# EAGLE design espiotv2 (EAGLE 7.6.0)
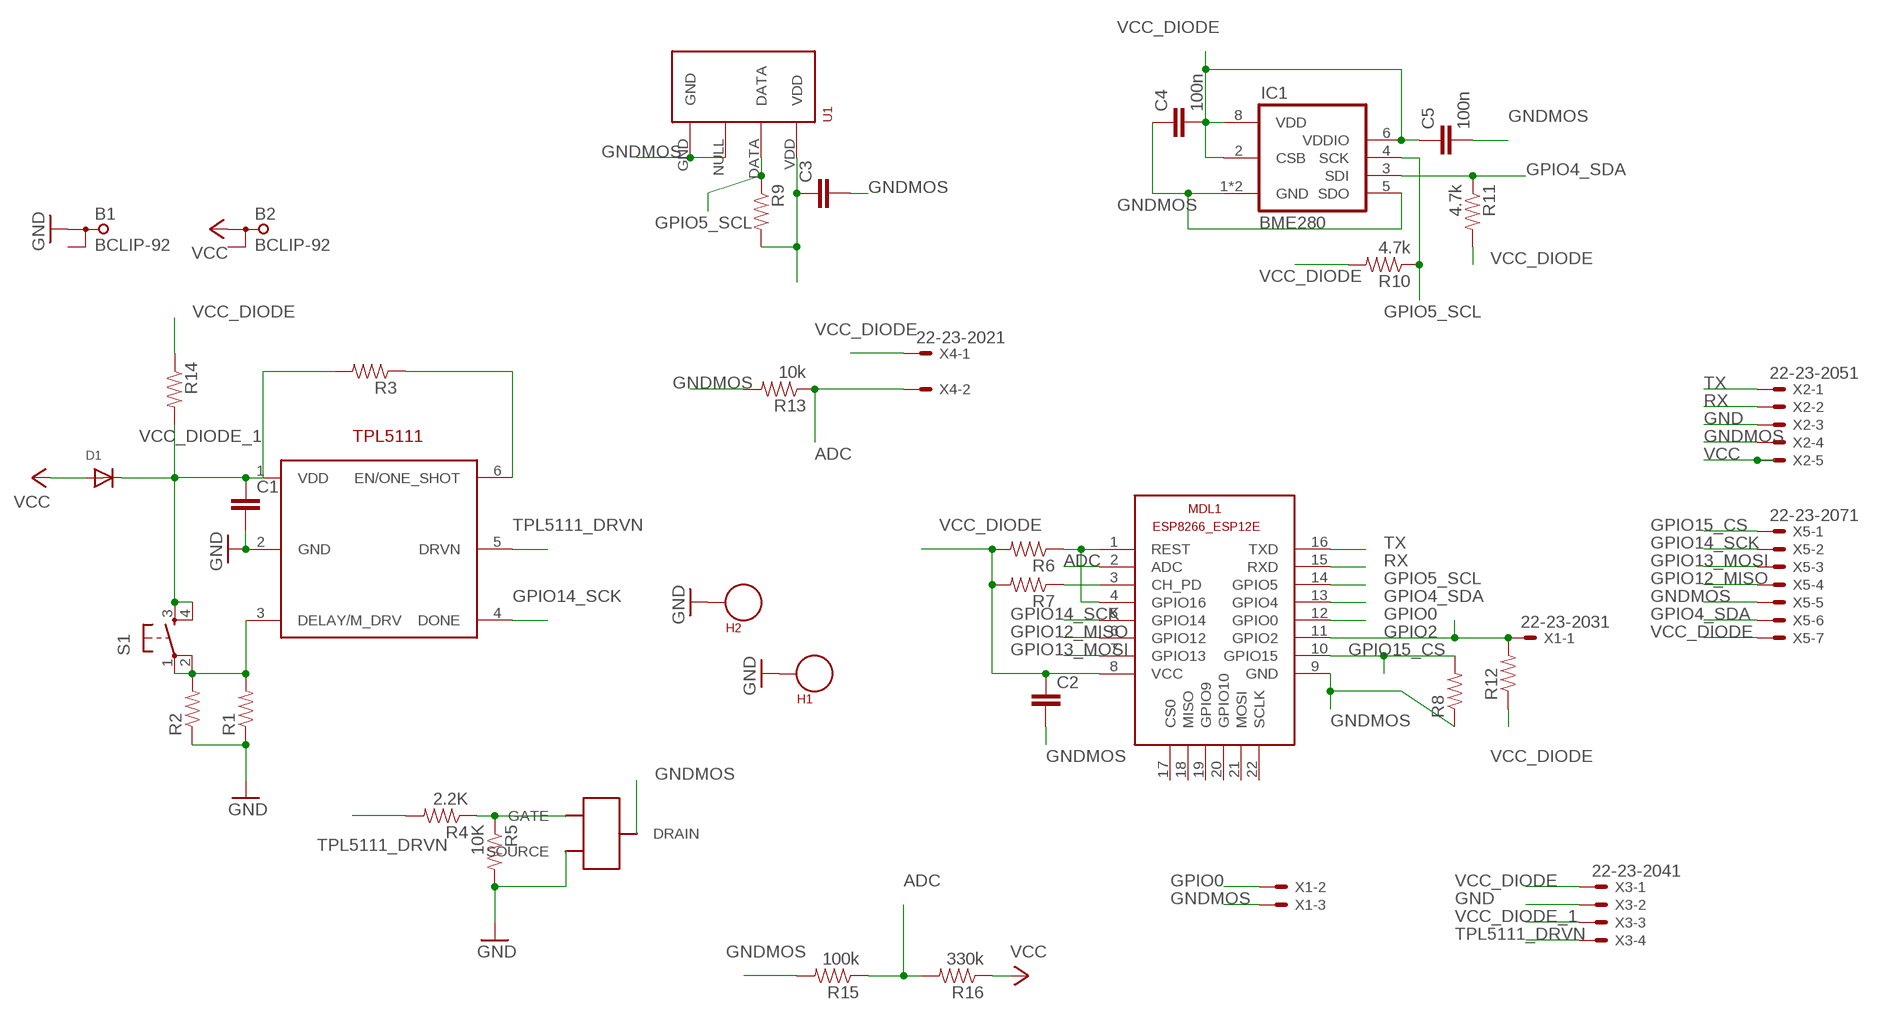
[diagram p0: schematic, sheet 1]

## Parts
B1  BCLIP-92  [BCLIP-92]
B2  BCLIP-92  [BCLIP-92]
C1  CAP0603-CAP  [0603-CAP]
C2  CAP0603-CAP  [0603-CAP]
C3  CAP0603-CAP  [0603-CAP]
C4  100n  CAP0603-CAP  [0603-CAP]
C5  100n  CAP0603-CAP  [0603-CAP]
D1  DIODEDO-1N4148  [DO-1N4148]
H1  SEW_HOLE  [SIMPLE_HOLE]
H2  SEW_HOLE  [SIMPLE_HOLE]
IC1  BME280  [BME280]
MDL1  ESP8266-12EESP8266-ESP12E  [ESP8266-ESP12E]
R1  RESISTOR0603-RES  [0603-RES]
R2  RESISTOR0603-RES  [0603-RES]
R3  RESISTOR0603-RES  [0603-RES]
R4  2.2K  RESISTOR0603-RES  [0603-RES]
R5  10K  RESISTOR0603-RES  [0603-RES]
R6  RESISTOR0603-RES  [0603-RES]
R7  RESISTOR0603-RES  [0603-RES]
R8  RESISTOR0603-RES  [0603-RES]
R9  RESISTOR0603-RES  [0603-RES]
R10  4.7k  RESISTOR0603-RES  [0603-RES]
R11  4.7k  RESISTOR0603-RES  [0603-RES]
R12  RESISTOR0603-RES  [0603-RES]
R13  10k  RESISTOR0603-RES  [0603-RES]
R14  RESISTOR0603-RES  [0603-RES]
R15  100k  RESISTOR0603-RES  [0603-RES]
R16  330k  RESISTOR0603-RES  [0603-RES]
S1  TAC_SWITCHPTH  [TACTILE-PTH]
U1  RHT03_DHT-22_AM2302WIRED  [AM2302]
U$1  TPL5111  [TPL5111]
U$2  IRLML2502  [IRLML2502]
X1  22-23-2031  [22-23-2031]
X2  22-23-2051  [22-23-2051]
X3  22-23-2041  [22-23-2041]
X4  22-23-2021  [22-23-2021]
X5  22-23-2071  [22-23-2071]

## Nets
ADC: MDL1.2(ADC) R13.1 R15.1 R16.2 X4.2
GND: B1.P$1 C1.2 H1.P$1 H2.P$1 R1.1 R2.1 R5.2 U$1.2(GND) U$2.S(SOURCE) X2.3 X3.2
GNDMOS: C2.2 C3.2 C4.1 C5.2 IC1.1(GND) IC1.5(SDO) IC1.7(GND) MDL1.9(GND) R8.1 R13.2 R15.2 U1.GND U1.NULL U$2.D(DRAIN) X1.3 X2.4 X5.5
GPIO0: MDL1.12(GPIO0) X1.2
GPIO2: MDL1.11(GPIO2) R12.2 X1.1
GPIO4_SDA: IC1.3(SDI) MDL1.13(GPIO4) R11.1 X5.6
GPIO5_SCL: IC1.4(SCK) MDL1.14(GPIO5) R9.1 R10.1 U1.DATA
GPIO12_MISO: MDL1.6(GPIO12) X5.4
GPIO13_MOSI: MDL1.7(GPIO13) X5.3
GPIO14_SCK: MDL1.5(GPIO14) U$1.4(DONE) X5.2
GPIO15_CS: MDL1.10(GPIO15) R8.2 X5.1
N$2: R4.1 R5.1 U$2.G(GATE)
N$3: R1.2 R2.2 S1.1 S1.2 U$1.3(DELAY/M_DRV)
N$4: MDL1.1(REST) MDL1.4(GPIO16) R6.1
N$5: MDL1.3(CH_PD) R7.1
N$6: R3.1 U$1.6(EN/ONE_SHOT)
RX: MDL1.15(RXD) X2.2
TPL5111_DRVN: R4.2 U$1.5(DRVN) X3.4
TX: MDL1.16(TXD) X2.1
VCC: B2.P$1 D1.A R16.1 X2.5
VCC_DIODE: C2.1 C3.1 C4.2 C5.1 IC1.2(CSB) IC1.6(VDDIO) IC1.8(VDD) MDL1.8(VCC) R6.2 R7.2 R9.2 R10.2 R11.2 R12.1 R14.1 U1.VDD X3.1 X4.1 X5.7
VCC_DIODE_1: C1.1 D1.C R3.2 R14.2 S1.3 S1.4 U$1.1(VDD) X3.3
Unconnected: B1.P$2 B2.P$2 MDL1.17(CS0) MDL1.18(MISO) MDL1.19(GPIO9) MDL1.20(GPIO10) MDL1.21(MOSI) MDL1.22(SCLK)

## Library data of the parts
B1 B2 = keystone_clip:BCLIP-92: Battery Clip - #92
C1-C5 = SparkFun-Capacitors:CAP: Capacitor Standard 0603 ceramic capacitor, and 0.1" leaded capacitor.
D1 = adafruit:DIODE: Diode SMADIODE - SMA Surface Mount Package 20V 1A Schottky Diode Digikey: 641-1014-6-ND DO-1N4148 - Through Hole Small Current Diode SOD-123 20V 1 A (.5mV Vf) Schottky Diode - Digikey: MBRX120TPMSCT-ND SOD-323 10V 570mA (.38mV Vf, 3ns) Schottky Diode - Digikey: ZLLS410CT-ND SOD-523 30V 30mA Schottky Diode (RB751S-40TE61) - Digikey: RB751S-40TE61CT-ND SOT23-R/W - SOT23 Package (R = Solder Paste/Reflow Ovens, W = Hand-Soldering) BAT54Film 40V 300mA - Digikey: 497-7162-1-ND
H1 H2 = LilyPad-Wearables (2):SEW_HOLE: Simple sew-hole .1" diameter hole with 20mil annular ring
IC1 = bosch-bme280:BME280: DIGITAL HUMIDITY, PRESSURE AND TEMPERATURE SENSOR * Digital interface I²C (up to 3.4 MHz) and SPI (3 and 4 wire, up to 10 MHz)* Supply voltage VDD main supply voltage range: 1.71 V to 3.6 V*VDDIO interface voltage range: 1.2 V to 3.6 V Operating range -40…+85 °C, 0…100 % rel. humidity, 300…1100 hPa The library has been designed by Richard Magdycz <https://www.facebook.com/groups/eaglecadsoftUK>
MDL1 = esp-12E:ESP8266-12E: ESP8266-12E with additional I/O and GPIO04/05 corrected The author cannot warrant that this library is free from error or will meet your specific requirements. Created by PuceBaboon.com. Komagane, Nagano, JAPAN
R1-R16 = SparkFun:RESISTOR: Resistor Basic schematic elements and footprints for 0603, 1206, and PTH resistors.
S1 = SparkFun:TAC_SWITCH: Momentary Switch Button commonly used for reset or general input. Spark Fun Electronics SKU : COM-00097
U1 = dht-22:RHT03_DHT-22_AM2302: RHT03 / DHT-22 / AM2302 Packages and symbol for the RHT03 / DHT-22 relative humidity and temperature sensor. Note: The AM2302 is a wired version of the DHT-22 which typically requires less clearance and is thus provided as a separate package.; PROD_ID: SEN-10167
U$1 = TPL5111_2:TPL5111
U$2 = IRLML2502:IRLML2502
X1 = con-molex:22-23-2031: .100" (2.54mm) Center Header - 3 Pin; MF: MOLEX; MPN: 22-23-2031; OC_FARNELL: 1462950; OC_NEWARK: 30C0862
X2 = con-molex:22-23-2051: .100" (2.54mm) Center Header - 5 Pin; MF: MOLEX; MPN: 22-23-2051; OC_FARNELL: 1462952; OC_NEWARK: 38C9178
X3 = con-molex:22-23-2041: .100" (2.54mm) Center Header - 4 Pin; MF: MOLEX; MPN: 22-23-2041; OC_FARNELL: 1462920; OC_NEWARK: 38C0355
X4 = con-molex:22-23-2021: .100" (2.54mm) Center Header - 2 Pin; MF: MOLEX; MPN: 22-23-2021; OC_FARNELL: 1462926; OC_NEWARK: 25C3832
X5 = con-molex:22-23-2071: .100" (2.54mm) Center Header - 7 Pin; MF: MOLEX; MPN: 22-23-2071; OC_FARNELL: 1654534; OC_NEWARK: 56H0445

## Board
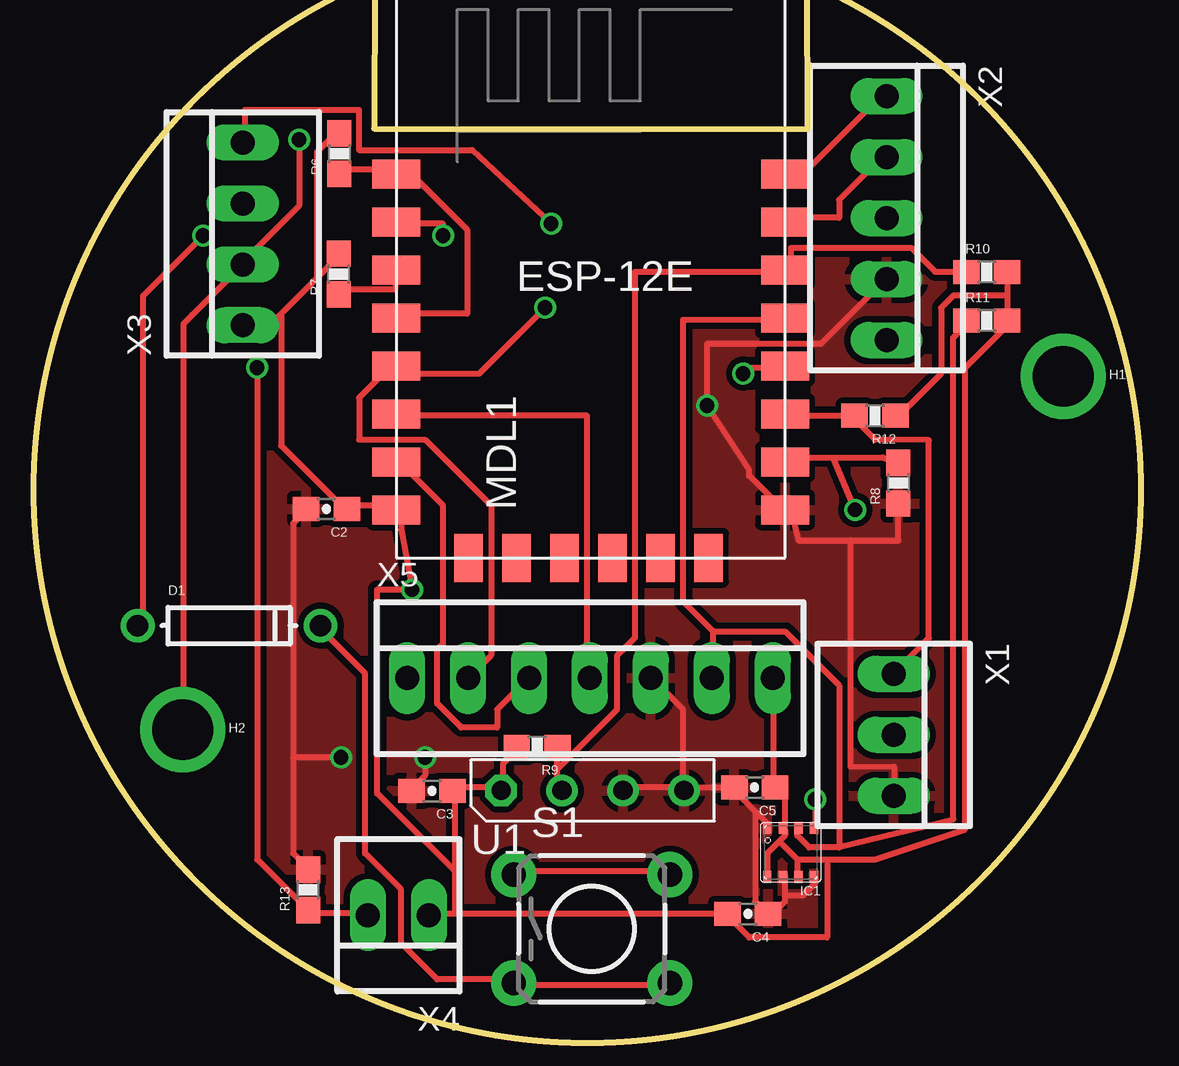
[diagram p1: board, top side]
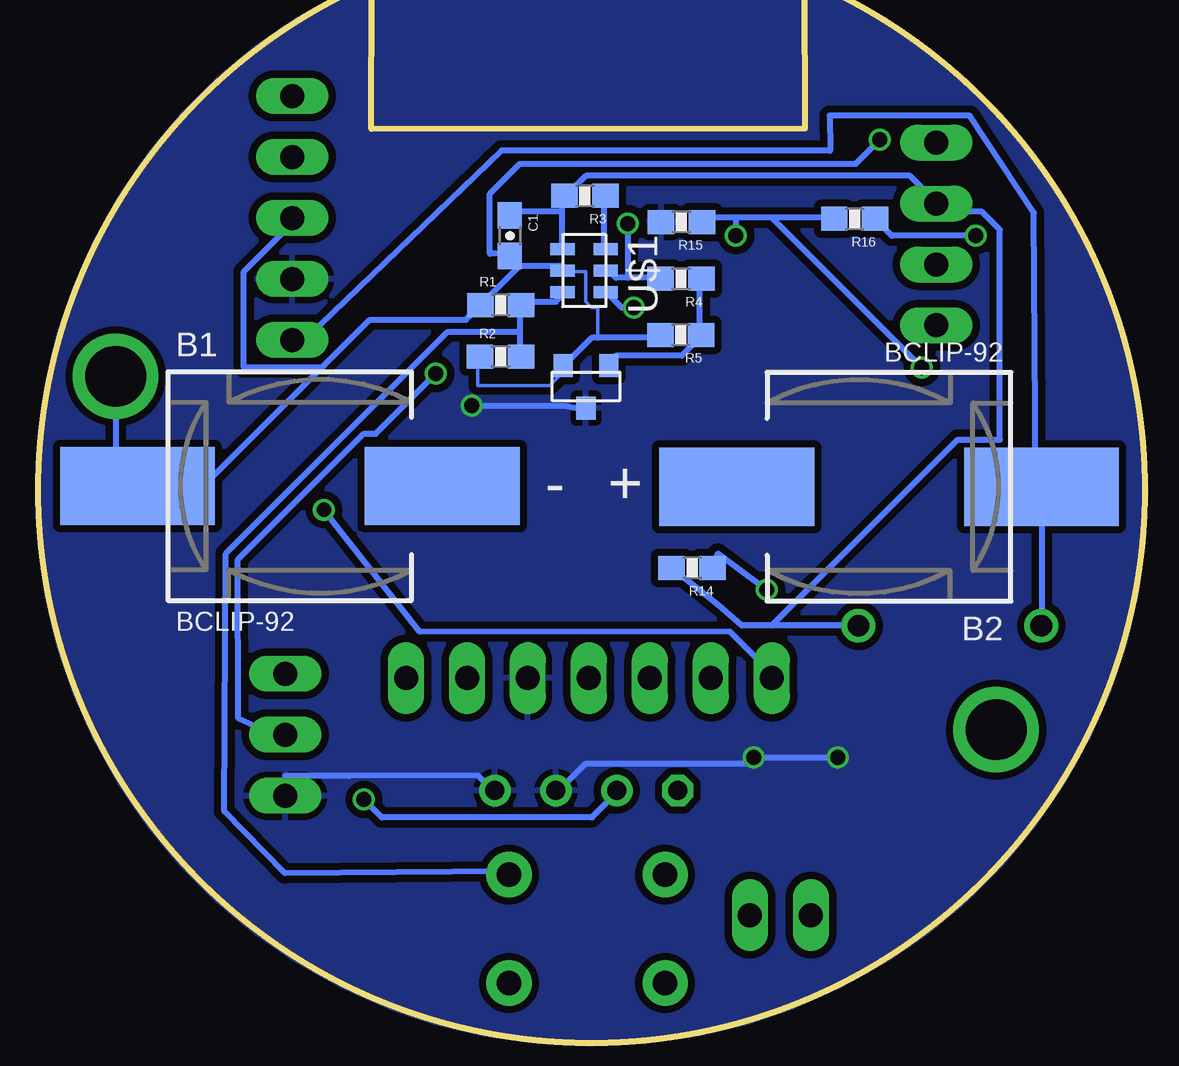
[diagram p2: board, bottom side, seen from below]

No outline drawn. Coordinates in mm, seen from the top.
Copper layers (1*16): Top 0.035mm / dielectric 1.5mm / Bottom 0.035mm
Design rules "SeeedStudio_2layer_DRU_no_angle_20140221": minimum track width 6mil, minimum drill 12mil, track to track 6mil, track to pad 6mil, pad to pad 6mil, via to via 6mil, smd to smd 0mil, copper to edge 10mil, drill to drill 10mil, minimum pad ring 10mil, minimum via ring 6mil, stop-mask expansion 2mil, vias tented up to drill 100mil, thermal gap 10mil
Milling: area 0,-0.1 to 46.1,46; 3 lines

### Footprints (pad centres in the part's own frame; a part is rotated, then mirrored left to right if it is on the bottom)
BCLIP-92 = smd 6.452 x 3.251: P$1 -7.62,0; P$2 5.08,0
0603-CAP = smd 1.1 x 1: 1 -0.85,0; 2 0.85,0
DO-1N4148 = drill 0.9: A -3.81,0; C 3.81,0
SIMPLE_HOLE = drill 2.54 pad 3.048: P$1 0,0
BME280 = smd 0.35 x 0.5: 1 0.975,-1.025; 2 0.325,-1.025; 3 -0.325,-1.025; 4 -0.975,-1.025; 5 -0.975,1.025; 6 -0.325,1.025; 7 0.325,1.025; 8 0.975,1.025
ESP8266-ESP12E = smd 2 x 1.2: 1 0,16; 2 0,14; 3 0,12; 4 0,10; 5 0,8; 6 0,6; 7 0,4; 8 0,2; 9 16.2,2; 10 16.2,4; 11 16.2,6; 12 16.2,8; 13 16.2,10; 14 16.2,12; 15 16.2,14; 16 16.2,16 | smd 1.2 x 2: 17 11,0; 18 3,0; 19 5,0; 20 13,0; 21 7,0; 22 9,0
0603-RES = smd 1.1 x 1: 1 -0.85,0; 2 0.85,0
TACTILE-PTH = drill 1.016 pad 1.88: 1 -3.251,2.261; 2 3.251,2.261; 3 -3.251,-2.261; 4 3.251,-2.261
AM2302 = drill 0.8: DATA -1.27,0; GND 3.81,0; NULL 1.27,0 | drill 0.8 octagon: VDD -3.81,0
TPL5111 = smd 0.508 x 1.016: 1 -1.4,-0.7; 2 -0.5,-0.7; 3 0.4,-0.7; 4 0.4,1.1; 5 -0.5,1.1; 6 -1.4,1.1
IRLML2502 = smd 0.802 x 0.972: D 0,1; G -0.95,-0.77; S 0.95,-0.77
22-23-2031 = drill 1 long: 1 -2.54,0; 2 0,0; 3 2.54,0
22-23-2051 = drill 1 long: 1 -5.08,0; 2 -2.54,0; 3 0,0; 4 2.54,0; 5 5.08,0
22-23-2041 = drill 1 long: 1 -3.81,0; 2 -1.27,0; 3 1.27,0; 4 3.81,0
22-23-2021 = drill 1 long: 1 -1.27,0; 2 1.27,0
22-23-2071 = drill 1 long: 1 -7.62,0; 2 -5.08,0; 3 -2.54,0; 4 0,0; 5 2.54,0; 6 5.08,0; 7 7.62,0

### Placement (x,y rotation side)
B1  34.31,23.06 0 bottom
B2  11.88,23.03 180 bottom
C1  26.41,33.5 270 bottom
C2  12.14,22.11 180 top
C3  16.54,10.36 180 top
C4  29.7,5.23 180 top
C5  29.98,10.5 180 top
D1  8.08,17.24 0 top
H1  42.84,27.64 0 top
H2  6.16,12.91 0 top
IC1  31.48,7.79 180 top
MDL1  15.06,20.07 0 top
R1  26.79,30.61 0 bottom
R2  26.8,28.45 0 bottom
R3  23.28,35.16 180 bottom
R4  19.28,31.71 180 bottom
R5  19.29,29.36 180 bottom
R6  12.68,36.92 90 top
R7  12.65,31.9 90 top
R8  35.98,23.18 90 top
R9  20.92,12.19 180 top
R10  39.65,31.99 0 top
R11  39.65,29.95 0 top
R12  35,25.99 180 top
R13  11.37,6.23 90 top
R14  18.82,19.66 180 bottom
R15  19.26,34.07 180 bottom
R16  12.05,34.2 180 bottom
S1  23.2,4.6 0 top
U1  23.23,10.37 0 top
U$1  23.52,31.54 270 bottom
U$2  23.24,27.31 180 bottom
X1  35.78,12.69 270 top
X2  35.48,34.24 270 top
X3  8.65,33.57 90 top
X4  15.14,5.17 180 top
X5  23.12,15.05 0 top

### Tracks (layer width: path | path; a pad name or v marks a point on that pad's centre or on a via)
ADC  (via drill 0.61)
  Top 0.254: X4.2 13.75,5.25 11.5,5.25 R13.1 11.25,5.5 9.25,7.5 v9.25,28 | v17,33.5 17,34 15.25,34 MDL1.2
  Bottom 0.254: 15.5,34.25 13,34.25 R16.2 | 15.5,34.25 17,34.25 | 17,34.25 18.25,34.25 R15.1 | 17,34.25 v17,33.5 | 15.5,34.25 v9.25,28
GND  (via drill 0.61)
  Top 0.254: v11,37.5 11,34.75 8.75,32.5 X3.2 6.55,30.2 6.19,29.82 6.19,12.91 H2.P$1
  Bottom 0.152: R2.1 27.75,28.25 27.75,27.25 24.75,27.25 24,28 U$2.S | 22.75,29.25 22.75,30.5 23,30.5 23.25,30.75 23.25,32 24,32 U$1.2 | B1.P$1 42,23.25 42.75,23.25 42.84,23.27
  Bottom 0.254: U$2.S 24,28.25 23,29.25 22.75,29.25 20.25,29.25 R5.2 | 26,32.25 24.25,32.25 U$1.2 | 26,32.25 26.25,32.5 C1.2 | 26,32.25 27.5,30.75 R1.1 27.75,30.5 28.25,30 32.25,30 34.25,28 | 26,32.25 C1.2 | 34.25,28 39,23.25 41.75,23.25 B1.P$1 | 34.25,28 37.5,28 37.5,32 35.5,34 X2.3 | v11,37.5 12,36.5 26,36.5 27.25,35.25 27.25,32.75 26.5,32.75 C1.2 | H1.P$1 42.84,23.27
GNDMOS  (via drill 0.61)
  Top 0.254: 33.97,20.8 34.02,20.79 31.81,20.8 31.5,22 MDL1.9 31.25,22 29.75,23.5 29.75,23.75 v28,26.41 28,29 32.75,29 35.25,31.5 X2.4 | 33.97,20.8 35.97,20.79 R8.1 | 33.97,20.8 33.97,11.37 35.79,11.36 X1.3 | 10.75,11.75 10.75,21.5 11.25,22 C2.2 | 10.75,11.75 10.75,7.75 11.25,7.25 R13.2 | v16.25,11.75 16.25,11 15.75,10.5 C3.2 | 31.25,6 31.25,5.75 30.75,5.25 C4.1 30.5,5.25 30,5.75 30,9.5 | 31.25,6 31.25,6.75 IC1.7 | 31.25,6 32,6 32.5,6.5 32.5,6.75 IC1.5 | 30,9.5 29.25,10.25 C5.2 29,10.5 27.25,10.5 U1.GND 27,10.5 | 30,9.5 30.5,9 IC1.1 | 27,10.5 27,13.75 25.75,15 X5.5 | 27,10.5 24.5,10.5 U1.NULL | v12.75,11.75 10.75,11.75
  Bottom 0.254: v28,26.41 24.15,26.41 23.25,26.25 U$2.D | U1.NULL 24.25,10.5 23.25,11.5 16.5,11.5 v16.25,11.75 v12.75,11.75 | X1.3 35.78,10.97 33.11,10.98 27.75,11 27.25,10.5 U1.GND
  pour Bottom (isolate 0.305): 22.97,45.96 23.14,45.96 arc-90 46.08,23.03 46.08,22.71 arc-90 23.2,-0.16 22.9,-0.16 arc-90 -0.08,22.82 -0.08,22.91 arc-90 22.99,45.98
  pour Top (isolate 0.254): 22.91,45.96 22.93,45.96 arc-90 46.2,22.69 46.2,22.55 arc-90 23.49,-0.16 23.16,-0.16 arc-90 -0.05,23.06 -0.05,23.26 arc-90 22.7,46.01
GPIO0  (via drill 0.61)
  Top 0.254: v29.5,27.75 29.5,28 31.25,28 MDL1.12
  Bottom 0.254: v29.5,27.75 32,25.25 32.5,25.25 37.75,20 37.73,13.38 36.17,12.66 X1.2
GPIO2
  Top 0.254: MDL1.11 31.5,26 34,26 R12.2 34.25,25.75 35,25 37.24,24.97 37.24,16.72 X1.1
GPIO4_SDA
  Top 0.254: 33.5,8.03 33.5,14.75 31.25,17 28.25,17 | 33.5,8.03 33.5,8 32.25,8 31.75,8.5 31.75,8.75 IC1.3 | 28.25,17 28.25,15.25 X5.6 | 33.5,8.03 38.26,9.18 38.25,11.5 38.25,29.25 38.75,29.75 R11.1 | 28.25,17 27,18.25 27,30 31.25,30 MDL1.13
GPIO5_SCL  (via drill 0.61)
  Top 0.254: R10.1 38.75,32 37.5,32 36.5,33 31.5,33 31.5,32.25 MDL1.14 31.25,32 25,32 25,16.75 24.25,16 24.25,13.75 21.75,11.25 | v32.5,10 32.5,9 IC1.4 | 21.75,11.25 21.75,10.5 U1.DATA | 21.75,11.25 21.75,12 R9.1
  Bottom 0.254: v32.5,10 31.75,9.25 23,9.25 22,10.25 U1.DATA
GPIO12_MISO
  Top 0.254: MDL1.6 15.25,26 23,26 23,15.25 X5.4
GPIO13_MOSI
  Top 0.254: MDL1.7 15.25,24 17,22.25 17,16.5 16.75,16.25 16.75,14 17.75,13 19.25,13 19.25,13.75 20.5,15 X5.3
GPIO14_SCK  (via drill 0.61)
  Top 0.254: v21.25,30.5 18.5,27.75 15.25,27.75 15.25,28 MDL1.5 15,28.25 13.5,26.75 13.5,25 16.25,25 19,22.25 19,16 18.25,15.25 X5.2
  Bottom 0.254: v21.25,30.5 21.75,30.5 22.25,31 U$1.4
GPIO15_CS  (via drill 0.61)
  Top 0.254: 33.25,24.25 31.5,24.25 MDL1.10 | 33.25,24.25 35.32,24.25 R8.2 | v34.17,22.07 33.25,24.25
  Bottom 0.254: v34.17,22.07 30.16,16.98 17.25,17 15.5,15.25 X5.1
N$2
  Bottom 0.254: U$2.G 22.25,28.25 22,28.5 19.25,28.5 18.5,29.25 R5.1 18.5,29.5 18.5,31.5 R4.1
N$3
  Top 0.254: S1.1 20,7 26.25,7 S1.2
  Bottom 0.254: U$1.3 24.25,31 24.5,30.75 25.75,30.75 R1.2 26,30.5 26,29.5 | 26,29.5 26,28.5 R2.2 | 26,29.5 29,29.5 38.25,20.25 38.3,9.49 35.79,6.93 26.5,7 S1.2
N$4
  Top 0.254: R6.1 12.75,36.25 15,36.25 MDL1.1 15.25,36 15.75,36 18,33.75 18,30.25 15.25,30.25 MDL1.4
N$5
  Top 0.254: R7.1 12.75,31.25 15,31.25 15,32 MDL1.3
N$6
  Bottom 0.254: U$1.6 22.5,33 22.5,35 R3.1
RX
  Top 0.254: MDL1.15 31.5,34.25 33.5,34.25 33.5,35 35.25,36.75 X2.2
TPL5111_DRVN  (via drill 0.61)
  Top 0.254: v21.5,34 18.21,37.07 18.21,37.06 13.49,37.07 13.49,38.69 13.49,38.75 8.75,38.75 8.75,37.5 X3.4
  Bottom 0.254: 21.5,31.75 20.25,31.75 R4.2 | 21.5,31.75 22,31.75 22.25,32 U$1.5 | v21.5,34 21.5,31.75
TX
  Top 0.254: MDL1.16 32.08,36.15 35.08,39.15 35.25,39.25 X2.1
VCC  (via drill 0.61)
  Top 0.254: v7,33.5 4.5,31 4.5,17.25 D1.A
  Bottom 0.254: v7,33.5 10.5,33.5 11,34 R16.1 | X2.5 35.25,29.25 34.88,29.25 26.77,37.05 13.07,37.03 13.09,38.51 7.25,38.5 4.58,34.46 4.5,23.25 B2.P$1 4.25,23 4.25,17.25 D1.A
VCC_DIODE  (via drill 0.61)
  Top 0.254: 10.25,30.25 10,30 8.75,30 X3.1 | 10.25,30.25 11.75,31.75 | 11.75,31.75 12.5,32.5 R7.2 | 11.75,31.75 11.75,37 12.5,37.75 R6.2 | 10.25,30.25 10.25,24.75 12.75,22.25 C2.1 13,22.25 15,22.25 MDL1.8 15.25,22 15.25,21.25 v15.71,18.74 14.25,18.75 14.25,10.25 17.5,7 | R9.2 20,12 19.5,11.5 19.5,10.5 U1.VDD 19.25,10.5 17.5,10.5 C3.1 17.5,10.25 17.5,7 | 17.5,5.25 16.5,5.25 X4.1 | 17.5,5.25 28.75,5.25 C4.2 29,5 29.75,4.25 33,4.25 33,7.5 | 17.5,5.25 17.5,7 | 40.5,31 38.25,31 37.75,30.5 37.75,27.75 36,26 R12.1 | 40.5,31 40.5,31.75 R10.2 | 40.5,31 40.5,30 R11.2 40.5,29.75 38.75,28 38.75,8.75 35,7.5 33,7.5 | 31,8.25 31.25,8.5 31.25,8.75 IC1.2 31.25,9 31.25,10 31,10.25 C5.1 30.75,10.5 30.75,15 X5.7 | 31,8.25 30.5,7.75 30.5,7 IC1.8 | 31.75,7.5 31.75,7 IC1.6 | 31,8.25 31.75,7.5 | 31.75,7.5 33,7.5
  Bottom 0.254: v15.71,18.74 15.96,18.92 17.75,20.25 R14.1
VCC_DIODE_1
  Top 0.254: S1.4 26.25,2.25 20,2.25 S1.3 19.75,2.5 16.75,2.5 15.25,4 15.25,6.25 13.75,7.75 13.75,15.25 12,17 D1.C
  Bottom 0.254: 24.25,34.5 24.25,35 R3.2 24,35.25 23.25,36 9.75,36 8.75,35 X3.3 8.5,34.75 8.25,34.5 6.75,34.5 6,33.75 6,25 7.75,25 15.5,17.25 | 24.25,34.5 24.25,33 U$1.1 | 24.25,34.5 26.25,34.5 C1.1 | 15.5,17.25 12,17.25 D1.C | 15.5,17.25 16.75,17.25 17.73,18.1 R14.2

### Text on the board
bPlace: + | -